# EAGLE design pi1541 (EAGLE 7.7.0)
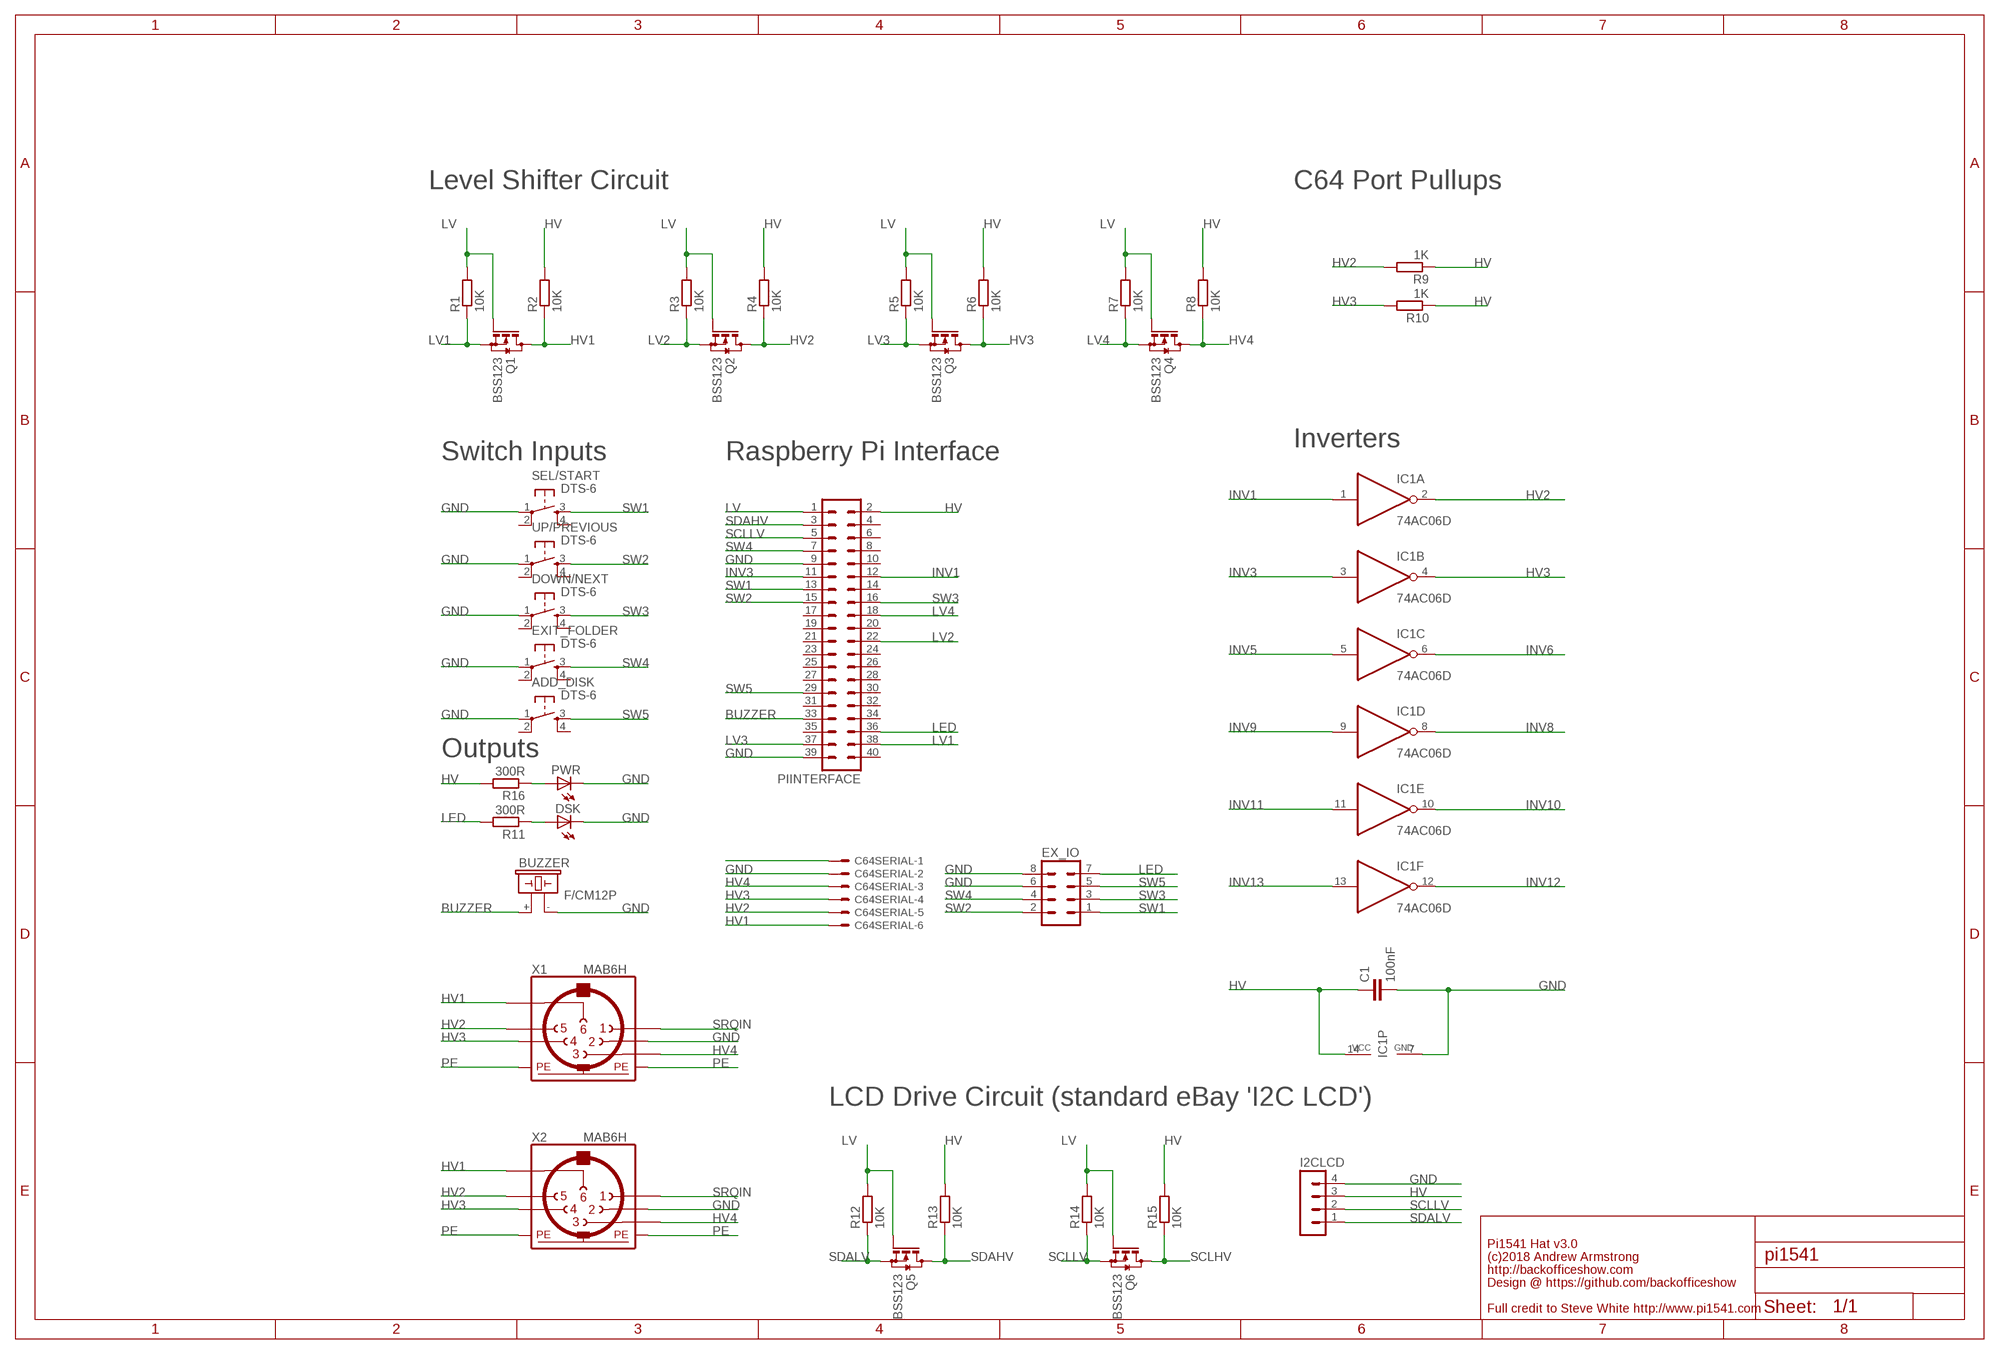
[diagram p0: schematic, sheet 1]

## Parts
ADD_DISK  DTS-6  [DTS-6]
BUZZER  F/CM12P  [F/CM12P]
C1  100nF  C-EUC0805  [C0805]
C64SERIAL  22-23-2061  [22-23-2061]
DOWN/NEXT  DTS-6  [DTS-6]
DSK  LEDCHIPLED_0805  [CHIPLED_0805]
EX_IO  MA04-2  [MA04-2]
EXIT_FOLDER  DTS-6  [DTS-6]
I2CLCD  MA04-1  [MA04-1]
IC1  74AC06D  [SO14]
PIINTERFACE  MA20-2  [MA20-2]
PWR  LEDCHIPLED_0805  [CHIPLED_0805]
Q1  BSS123  [SOT23]
Q2  BSS123  [SOT23]
Q3  BSS123  [SOT23]
Q4  BSS123  [SOT23]
Q5  BSS123  [SOT23]
Q6  BSS123  [SOT23]
R1  10K  R-EU_R0805  [R0805]
R2  10K  R-EU_R0805  [R0805]
R3  10K  R-EU_R0805  [R0805]
R4  10K  R-EU_R0805  [R0805]
R5  10K  R-EU_R0805  [R0805]
R6  10K  R-EU_R0805  [R0805]
R7  10K  R-EU_R0805  [R0805]
R8  10K  R-EU_R0805  [R0805]
R9  1K  R-EU_R0805  [R0805]
R10  1K  R-EU_R0805  [R0805]
R11  300R  R-EU_R0805  [R0805]
R12  10K  R-EU_R0805  [R0805]
R13  10K  R-EU_R0805  [R0805]
R14  10K  R-EU_R0805  [R0805]
R15  10K  R-EU_R0805  [R0805]
R16  300R  R-EU_R0805  [R0805]
SEL/START  DTS-6  [DTS-6]
UP/PREVIOUS  DTS-6  [DTS-6]
X1  MAB6H  [MAB6H]
X2  MAB6H  [MAB6H]

## Nets
BUZZER: BUZZER.+ PIINTERFACE.33
GND: ADD_DISK.1 BUZZER.- C1.2 C64SERIAL.2 DOWN/NEXT.1 DSK.C EX_IO.6 EX_IO.8 EXIT_FOLDER.1 I2CLCD.4 IC1.7(P:GND) PIINTERFACE.9 PIINTERFACE.39 PWR.C SEL/START.1 UP/PREVIOUS.1 X1.2 X2.2
HV: C1.1 I2CLCD.3 IC1.14(P:VCC) PIINTERFACE.2 R2.2 R4.2 R6.2 R8.2 R9.1 R10.1 R13.2 R15.2 R16.2
HV1: C64SERIAL.6 Q1.3(D) R2.1 X1.6 X2.6
HV2: C64SERIAL.5 IC1.2(A:O) Q2.3(D) R4.1 R9.2 X1.5 X2.5
HV3: C64SERIAL.4 IC1.4(B:O) Q3.3(D) R6.1 R10.2 X1.4 X2.4
HV4: C64SERIAL.3 Q4.3(D) R8.1 X1.3 X2.3
INV1: IC1.1(A:I) PIINTERFACE.12
INV3: IC1.3(B:I) PIINTERFACE.11
INV5: IC1.5(C:I)
INV6: IC1.6(C:O)
INV8: IC1.8(D:O)
INV9: IC1.9(D:I)
INV10: IC1.10(E:O)
INV11: IC1.11(E:I)
INV12: IC1.12(F:O)
INV13: IC1.13(F:I)
LED: EX_IO.7 PIINTERFACE.36 R11.2
LV: PIINTERFACE.1 Q1.1(G) Q2.1(G) Q3.1(G) Q4.1(G) Q5.1(G) Q6.1(G) R1.2 R3.2 R5.2 R7.2 R12.2 R14.2
LV1: PIINTERFACE.38 Q1.2(S) R1.1
LV2: PIINTERFACE.22 Q2.2(S) R3.1
LV3: PIINTERFACE.37 Q3.2(S) R5.1
LV4: PIINTERFACE.18 Q4.2(S) R7.1
N$1: DSK.A R11.1
N$2: C64SERIAL.1
N$4: PWR.A R16.1
PE: X1.PE X1.PE@(PE) X2.PE X2.PE@(PE)
SCLHV: Q6.3(D) R15.1
SCLLV: I2CLCD.2 PIINTERFACE.5 Q6.2(S) R14.1
SDAHV: PIINTERFACE.3 Q5.3(D) R13.1
SDALV: I2CLCD.1 Q5.2(S) R12.1
SRQIN: X1.1 X2.1
SW1: EX_IO.1 PIINTERFACE.13 SEL/START.3
SW2: EX_IO.2 PIINTERFACE.15 UP/PREVIOUS.3
SW3: DOWN/NEXT.3 EX_IO.3 PIINTERFACE.16
SW4: EX_IO.4 EXIT_FOLDER.3 PIINTERFACE.7
SW5: ADD_DISK.3 EX_IO.5 PIINTERFACE.29
Unconnected: ADD_DISK.2 ADD_DISK.4 DOWN/NEXT.2 DOWN/NEXT.4 EXIT_FOLDER.2 EXIT_FOLDER.4 PIINTERFACE.4 PIINTERFACE.6 PIINTERFACE.8 PIINTERFACE.10 PIINTERFACE.14 PIINTERFACE.17 PIINTERFACE.19 PIINTERFACE.20 PIINTERFACE.21 PIINTERFACE.23 PIINTERFACE.24 PIINTERFACE.25 PIINTERFACE.26 PIINTERFACE.27 PIINTERFACE.28 PIINTERFACE.30 PIINTERFACE.31 PIINTERFACE.32 PIINTERFACE.34 PIINTERFACE.35 PIINTERFACE.40 SEL/START.2 SEL/START.4 UP/PREVIOUS.2 UP/PREVIOUS.4

## Notes on the sheet
- Level Shifter Circuit | C64 Port Pullups
- Inverters
- Switch Inputs | Raspberry Pi Interface
- Outputs
- LCD Drive Circuit (standard eBay 'I2C LCD')
- Pi1541 Hat v3.0
- (c)2018 Andrew Armstrong
- http://backofficeshow.com
- Design @ https://github.com/backofficeshow
- Full credit to Steve White http://www.pi1541.com

## Library data of the parts
ADD_DISK DOWN/NEXT EXIT_FOLDER SEL/START UP/PREVIOUS = switch-tact:DTS-6
BUZZER = buzzer:F/CM12P: BUZZER Source: Buerklin
C1 = rcl:C-EU: CAPACITOR, European symbol
C64SERIAL = con-molex:22-23-2061: .100" (2.54mm) Center Header - 6 Pin
DSK PWR = led:LED: LED OSRAM: - CHIPLED LG R971, LG N971, LY N971, LG Q971, LY Q971, LO R971, LY R971 LH N974, LH R974 LS Q976, LO Q976, LY Q976 LO Q996 - Hyper CHIPLED LW Q18S LB Q993, LB Q99A, LB R99A - SideLED LS A670, LO A670, LY A670, LG A670, LP A670 LB A673, LV A673, LT A673, LW A673 LH A674 LY A675 LS A676, LA A676, LO A676, LY A676, LW A676 LS A679, LY A679, LG A679 - Hyper Micro SIDELED® LS Y876, LA Y876, LO Y876, LY Y876 LT Y87S - SmartLED LW L88C, LW L88S LB L89C, LB L89S, LG L890 LS L89K, LO L89K, LY L89K LS L896, LA L896, LO L896, LY L896 - TOPLED LS T670, LO T670, LY T670, LG T670, LP T670 LSG T670, LSP T670, LSY T670, LOP T670, LYG T670 LG T671, LOG T671, LSG T671 LB T673, LV T673, LT T673, LW T673 LH T674 LS T676, LA T676, LO T676, LY T676, LB T676, LH T676, LSB T676, LW T676 LB T67C, LV T67C, LT T67C, LS T67K, LO T67K, LY T67K, LW E67C LS E67B, LA E67B, LO E67B, LY E67B, LB E67C, LV E67C, LT E67C LW T67C LS T679, LY T679, LG T679 LS T770, LO T770, LY T770, LG T770, LP T770 LB T773, LV T773, LT T773, LW T773 LH T774 LS E675, LA E675, LY E675, LS T675 LS T776, LA T776, LO T776, LY T776, LB T776 LHGB T686 LT T68C, LB T68C - Hyper Mini TOPLED® LB M676 - Mini TOPLED Santana® LG M470 LS M47K, LO M47K, LY M47K Source: http://www.osram.convergy.de LUXEON: - LUMILED® LXK2-PW12-R00, LXK2-PW12-S00, LXK2-PW14-U00, LXK2-PW14-V00 LXK2-PM12-R00, LXK2-PM12-S00, LXK2-PM14-U00 LXK2-PE12-Q00, LXK2-PE12-R00, LXK2-PE12-S00, LXK2-PE14-T00, LXK2-PE14-U00 LXK2-PB12-K00, LXK2-PB12-L00, LXK2-PB12-M00, LXK2-PB14-N00, LXK2-PB14-P00, LXK2-PB14-Q00 LXK2-PR12-L00, LXK2-PR12-M00, LXK2-PR14-Q00, LXK2-PR14-R00 LXK2-PD12-Q00, LXK2-PD12-R00, LXK2-PD12-S00 LXK2-PH12-R00, LXK2-PH12-S00 LXK2-PL12-P00, LXK2-PL12-Q00, LXK2-PL12-R00 Source: www.luxeon.com KINGBRIGHT: KA-3528ASYC Source: www.kingbright.com
EX_IO = con-lstb:MA04-2: PIN HEADER
I2CLCD = con-lstb:MA04-1: PIN HEADER
IC1 = 74xx-eu:74*06: Hex INVERTER, open collector high-voltage output
PIINTERFACE = con-lstb:MA20-2: PIN HEADER
Q1-Q6 = transistor-small-signal:BSS123: N-CHANNEL MOS FET
R1-R16 = resistor:R-EU_: RESISTOR, European symbol
X1 X2 = con-hirschmann:MAB6H: Female CONNECTOR 6 pins with shield, horizontal (DIN 45322)

## Net classes
0 default: width 0.3 mm

## Board
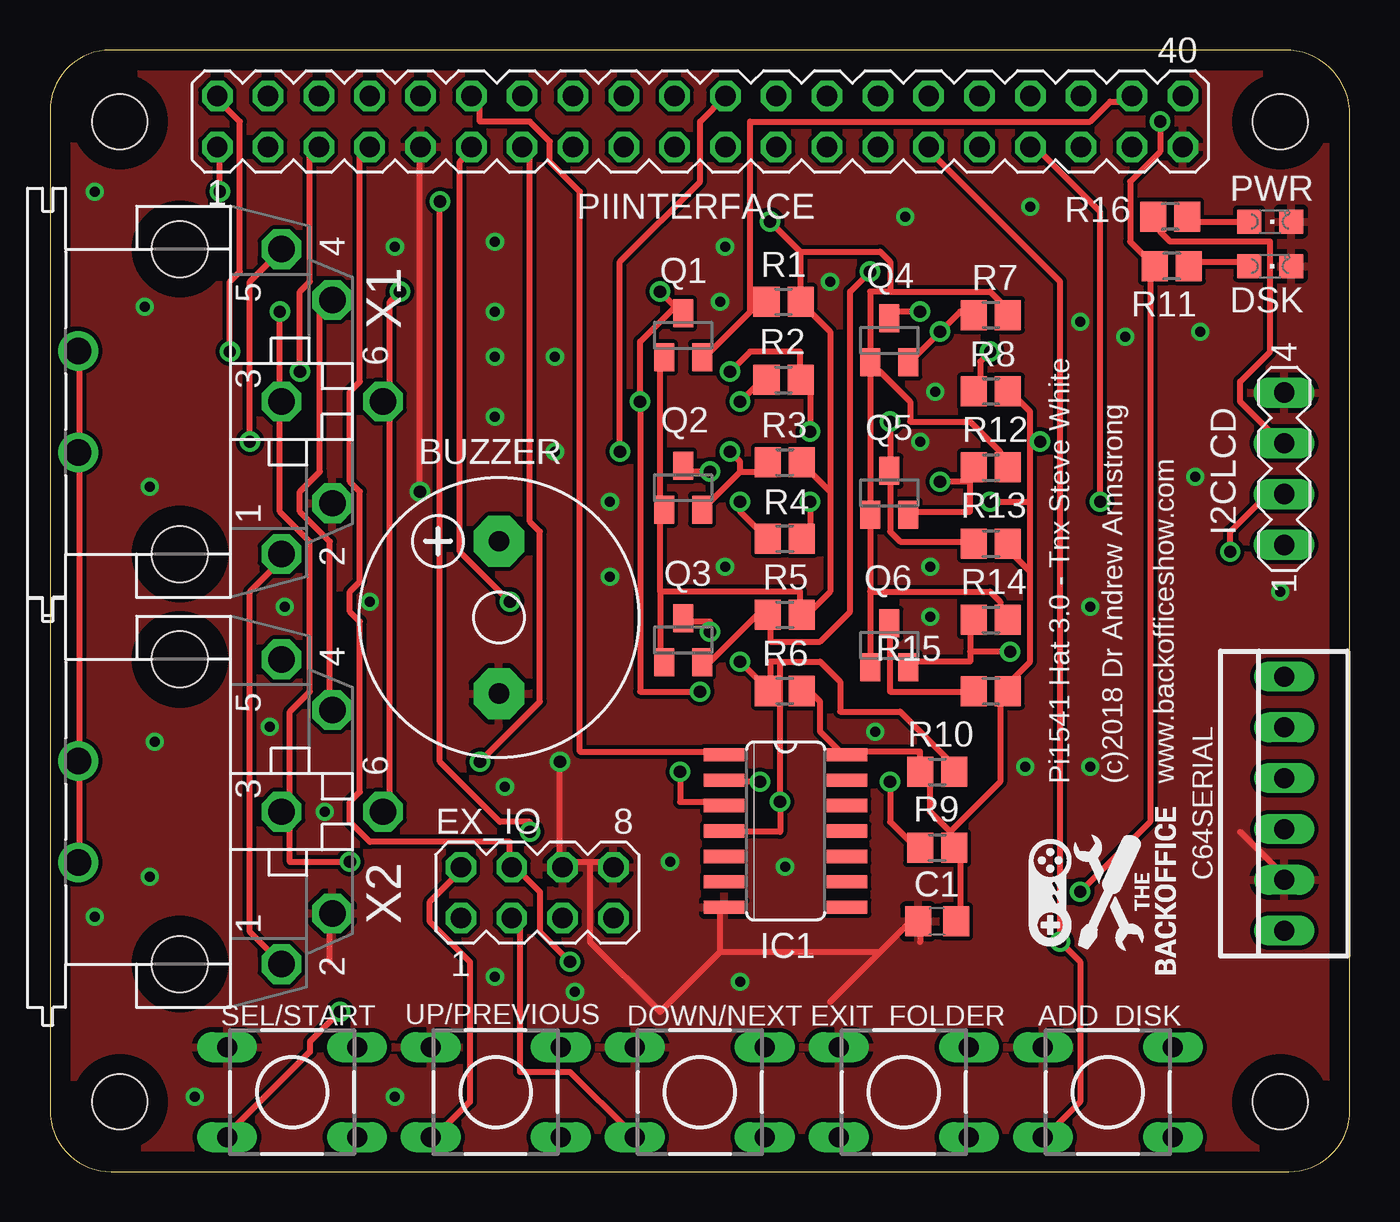
[diagram p1: board, top side]
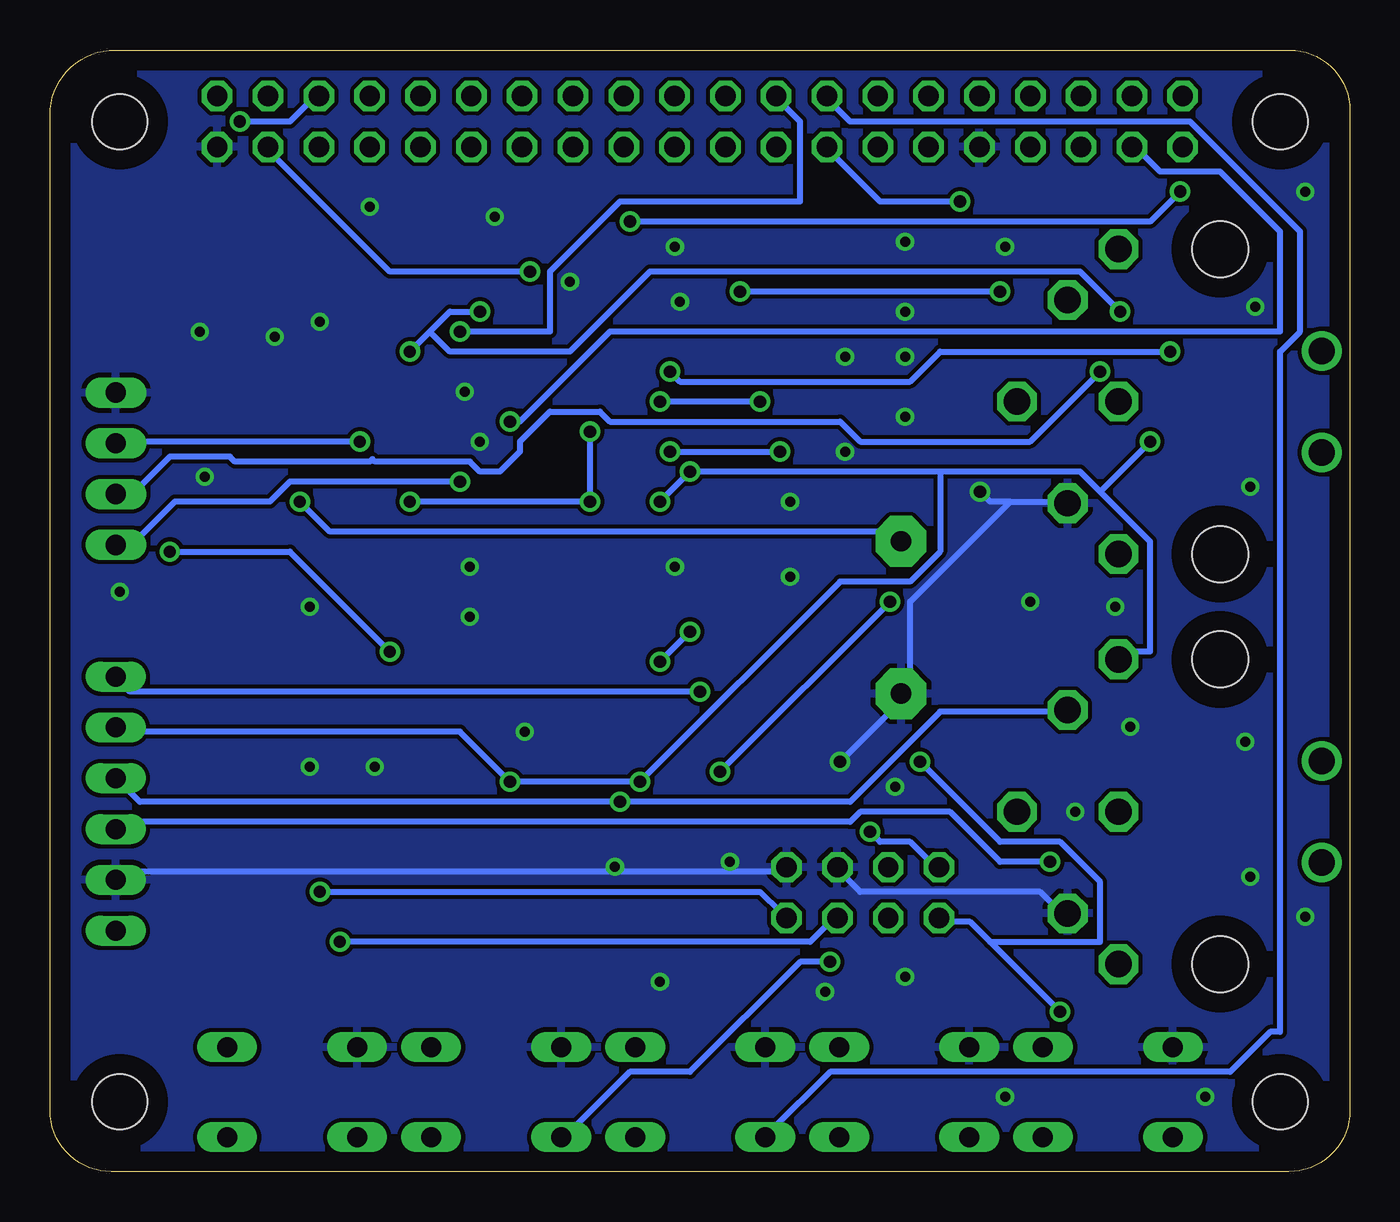
[diagram p2: board, bottom side, seen from below]

Size 64.98 x 56.07 mm. Coordinates in mm from the lower left corner, seen from the top.
Outline: 61.91,0 arc90 64.98,3.07 64.98,52.82 arc90 61.73,56.07 3.02,56.07 arc90 0,53.05 0,3.07 arc90 3.07,0 61.91,0
Copper layers (1*16): Top 0.035mm / dielectric 1.5mm / Bottom 0.035mm
Design rules "default *": minimum track width 10mil, minimum drill 24mil, track to track 8mil, track to pad 8mil, pad to pad 8mil, via to via 8mil, smd to smd 8mil, copper to edge 40mil, drill to drill 8mil, minimum pad ring 10mil, minimum via ring 8mil, stop-mask expansion 4mil, vias tented up to drill 0.7mm, thermal gap 10mil
Holes 2.75 mm at 3.49,3.49 61.49,3.49 3.49,52.49 61.49,52.49

### Footprints (pad centres in the part's own frame; a part is rotated, then mirrored left to right if it is on the bottom)
DTS-6 = drill 1 long: 1 -3.25,2.25; 2 3.25,2.25; 3 -3.25,-2.25; 4 3.25,-2.25
F/CM12P = drill 1.016 pad 2.54 octagon: + 3.81,0; - -3.81,0
C0805 = smd 1.3 x 1.5: 1 -0.95,0; 2 0.95,0
22-23-2061 = drill 1 long: 1 -6.35,0; 2 -3.81,0; 3 -1.27,0; 4 1.27,0; 5 3.81,0; 6 6.35,0
CHIPLED_0805 = smd 1.2 x 1.2: A 0,-1.05; C 0,1.05
MA04-2 = drill 1.016 octagon: 1 -3.81,-1.27; 2 -3.81,1.27; 3 -1.27,-1.27; 4 -1.27,1.27; 5 1.27,-1.27; 6 1.27,1.27; 7 3.81,-1.27; 8 3.81,1.27
MA04-1 = drill 1.016 long: 1 -3.81,0; 2 -1.27,0; 3 1.27,0; 4 3.81,0
SO14 = smd 0.66 x 2.032: 1 -3.81,-3.073; 2 -2.54,-3.073; 3 -1.27,-3.073; 4 0,-3.073; 5 1.27,-3.073; 6 2.54,-3.073; 7 3.81,-3.073; 8 3.81,3.073; 9 2.54,3.073; 10 1.27,3.073; 11 0,3.073; 12 -1.27,3.073; 13 -2.54,3.073; 14 -3.81,3.073
MA20-2 = drill 1.016 octagon: 1 -24.13,-1.27; 2 -24.13,1.27; 3 -21.59,-1.27; 4 -21.59,1.27; 5 -19.05,-1.27; 6 -19.05,1.27; 7 -16.51,-1.27; 8 -16.51,1.27; 9 -13.97,-1.27; 10 -13.97,1.27; 11 -11.43,-1.27; 12 -11.43,1.27; 13 -8.89,-1.27; 14 -8.89,1.27; 15 -6.35,-1.27; 16 -6.35,1.27; 17 -3.81,-1.27; 18 -3.81,1.27; 19 -1.27,-1.27; 20 -1.27,1.27; 21 1.27,-1.27; 22 1.27,1.27; 23 3.81,-1.27; 24 3.81,1.27; 25 6.35,-1.27; 26 6.35,1.27; 27 8.89,-1.27; 28 8.89,1.27; 29 11.43,-1.27; 30 11.43,1.27; 31 13.97,-1.27; 32 13.97,1.27; 33 16.51,-1.27; 34 16.51,1.27; 35 19.05,-1.27; 36 19.05,1.27; 37 21.59,-1.27; 38 21.59,1.27; 39 24.13,-1.27; 40 24.13,1.27
SOT23 = smd 1 x 1.4: 1 -0.95,-1.1; 2 0.95,-1.1; 3 0,1.1
R0805 = smd 1.3 x 1.5: 1 -0.85,0; 2 0.85,0
MAB6H = drill 1.321 octagon: 1 7.62,5.08; 2 5.08,7.62; 3 0,5.08; 4 -5.08,7.62; 5 -7.62,5.08; 6 0,10.16 | drill 1.321: PE -2.54,-5.08; PE@ 2.54,-5.08 | hole 2.794: 7.62,0; -7.62,0

### Placement (x,y rotation side)
ADD_DISK  52.88,3.98 0 top
BUZZER  22.44,27.71 90 top
C1  44.34,12.51 180 top
C64SERIAL  61.69,18.4 90 top
DOWN/NEXT  32.48,3.98 0 top
DSK  60.99,45.27 270 top
EX_IO  24.35,13.95 0 top
EXIT_FOLDER  42.68,3.98 0 top
I2CLCD  61.69,35.14 90 top
IC1  36.77,17.03 270 top
PIINTERFACE  32.49,52.49 0 top
PWR  60.99,47.49 270 top
Q1  31.65,41.81 0 top
Q2  31.65,34.19 0 top
Q3  31.65,26.57 0 top
Q4  41.95,41.55 0 top
Q5  41.95,33.93 0 top
Q6  41.95,26.31 0 top
R1  36.66,43.49 0 top
R2  36.66,39.59 0 top
R3  36.73,35.46 0 top
R4  36.73,31.65 0 top
R5  36.73,27.84 0 top
R6  36.73,24.03 0 top
R7  47.03,42.82 0 top
R8  47.03,39.01 0 top
R9  44.34,16.19 180 top
R10  44.35,19.99 0 top
R11  56.07,45.27 180 top
R12  47.03,35.2 0 top
R13  47.03,31.39 0 top
R14  47.03,27.58 0 top
R15  47.03,24.02 0 top
R16  55.99,47.74 180 top
SEL/START  12.1,3.98 0 top
UP/PREVIOUS  22.28,3.98 0 top
X1  6.49,38.49 270 top
X2  6.49,17.99 270 top

### Tracks (layer width: path | path; a pad name or v marks a point on that pad's centre or on a via)
BUZZER  (via drill 0.61)
  Top 0.3: v52.49,33.49 52.49,47.99 49.49,50.99 PIINTERFACE.33
  Bottom 0.3: v52.49,33.49 50.99,31.99 22.49,31.99 BUZZER.+
GND  (via drill 0.5, 0.61)
  Top 0.3: v18.49,33.99 18.49,50.99 PIINTERFACE.9 | 33.49,10.99 30.49,7.99 26.99,11.49 26.99,15.49 | 33.49,10.99 33.49,12.99 IC1.7 | 41.49,10.99 38.99,8.49 | 41.49,10.99 42.99,12.49 C1.2 43.49,12.49 43.49,11.49 | 33.49,10.99 41.49,10.99 | 13.99,10.49 13.99,12.49 X2.2 | 26.99,15.49 27.99,15.49 EX_IO.8 | 26.99,15.49 25.99,15.49 EX_IO.6 25.49,15.49 v25.49,20.49 | 59.49,16.99 61.49,14.99 C64SERIAL.2
  Bottom 0.3: v18.49,33.99 17.99,33.49 16.99,33.49 | 16.99,33.49 14.49,33.49 X1.2 | 16.99,33.49 21.99,28.49 21.99,23.99 BUZZER.- 22.49,23.49 v25.49,20.49 | C64SERIAL.2 61.49,14.99 28.49,14.99 EX_IO.8 | X2.2 14.49,12.99 15.49,13.99 24.49,13.99 25.49,14.99 EX_IO.6
  other vias: 27.99,29.74 27.99,33.49 25.24,35.99 25.24,40.74 42.74,47.74 53.74,41.74 22.24,46.49 17.24,46.24 4.74,43.24 2.24,48.99 4.99,14.74 22.24,9.74 26.24,8.99 36.74,15.24 51.99,28.24 61.49,28.99 43.99,30.24 57.49,41.99 48.99,48.24 51.49,42.49 22.24,42.99 22.24,40.74 33.74,46.24 33.49,43.49 51.99,20.24 41.24,21.99 33.74,30.24 22.74,19.24 30.99,15.49 11.74,28.24 10.99,22.24 13.74,17.99 15.99,28.49 22.24,37.74 38.99,44.49 48.74,20.24 43.99,27.74 4.99,34.24 5.24,21.49 17.24,3.74 7.24,3.74 34.49,9.49 2.24,12.74 44.24,38.99 43.49,36.49 57.24,34.74
  pour Top: -8.51,57.49 67.99,57.49 67.99,-8.01 -9.51,-8.01 -9.51,56.49
  pour Bottom: -2.01,58.74 74.49,58.74 74.49,-4.76 -6.01,-4.76 -6.01,58.49
HV  (via drill 0.61)
  Top 0.3: R6.2 37.99,23.99 38.49,23.49 38.49,21.99 39.49,20.99 IC1.14 39.99,20.99 43.49,20.99 R10.1 43.99,19.49 43.99,17.99 44.99,16.99 | C1.1 45.49,12.99 45.49,15.99 R9.1 44.99,16.49 44.99,16.99 | 44.99,16.99 47.49,19.49 47.49,23.99 R15.2 47.99,24.49 48.99,25.49 48.99,29.99 | R16.2 55.49,47.49 55.49,46.99 55.99,46.49 60.99,46.49 60.99,40.99 59.49,39.49 59.49,38.49 61.49,36.49 I2CLCD.3 | 48.99,29.99 47.99,30.99 R13.2 | 48.99,29.99 48.99,33.49 | 48.99,33.49 48.99,36.49 | 48.99,36.49 48.99,37.99 47.99,38.99 R8.2 | v37.99,33.49 37.99,31.99 R4.2 | v37.99,36.99 37.99,39.49 R2.2 37.49,39.99 37.49,40.99 34.99,40.99 v33.99,39.99 | v8.99,40.99 8.99,44.49 9.49,44.99 9.49,52.49 8.49,53.49 PIINTERFACE.2 | v46.99,33.49 48.99,33.49 | 48.99,36.49 v49.49,36.49
  Bottom 0.3: v37.99,36.99 v37.99,33.49 v46.99,33.49 | v8.99,40.99 20.49,40.99 21.99,39.49 33.49,39.49 v33.99,39.99 | v49.49,36.49 61.49,36.49 I2CLCD.3
HV1  (via drill 0.61)
  Top 0.3: v30.49,43.99 31.24,43.24 | 31.24,43.24 31.49,42.99 Q1.3 31.24,43.24 | v17.49,43.99 16.99,43.49 16.99,38.49 | v34.49,38.49 35.49,39.49 R2.1 | v32.49,23.99 29.49,23.99 v29.49,38.49 29.49,41.49 31.24,43.24 | 16.99,38.49 16.99,17.99 X2.6 | 16.99,38.49 X1.6
  Bottom 0.3: v17.49,43.99 v30.49,43.99 | v29.49,38.49 v34.49,38.49 | v32.49,23.99 60.99,23.99 61.49,24.49 C64SERIAL.6
HV2  (via drill 0.61)
  Top 0.3: v41.99,19.49 41.99,17.49 42.99,16.49 R9.2 | v35.49,19.49 33.99,19.49 IC1.2 | v32.99,34.99 31.99,34.99 Q2.3 | v34.49,33.49 34.49,32.99 35.49,31.99 R4.1 | v9.99,36.49 9.99,44.49 11.49,45.99 X1.5
  Bottom 0.3: C64SERIAL.5 61.49,21.99 44.49,21.99 v41.99,19.49 v35.49,19.49 25.49,29.49 21.99,29.49 20.49,30.99 20.49,34.99 | 20.49,34.99 13.49,34.99 12.49,33.99 | 20.49,34.99 v32.99,34.99 v34.49,33.49 | 12.49,33.99 9.99,31.49 9.99,25.99 11.49,25.99 X2.5 | 12.49,33.99 v9.99,36.49
HV3  (via drill 0.61)
  Top 0.3: v32.99,26.99 32.99,27.49 31.99,27.49 Q3.3 | v34.49,25.49 35.49,24.49 R6.1 35.99,24.49 35.99,25.49 36.49,25.49 | 36.49,25.49 38.49,25.49 39.49,24.49 39.49,22.99 42.49,22.99 44.99,20.49 44.99,19.99 R10.2 | 36.49,25.49 v36.49,18.49 36.49,16.99 33.99,16.99 IC1.4 | X1.4 13.99,43.49 13.49,42.99 13.49,34.99 12.49,33.99 12.49,32.99 13.99,31.49 13.99,23.49 X2.4
  Bottom 0.3: v34.49,25.49 v32.99,26.99 | C64SERIAL.4 61.49,19.49 60.49,18.49 v36.49,18.49 24.99,18.49 20.49,22.99 14.49,22.99 X2.4
HV4  (via drill 0.61)
  Top 0.3: v43.49,42.99 41.99,42.99 Q4.3 | v46.99,40.99 46.49,40.49 46.49,39.49 R8.1 | v14.99,15.49 11.99,15.49 11.99,17.99 | 11.49,38.49 11.49,32.99 12.99,31.49 12.99,23.99 11.99,22.99 11.99,17.99 | 11.99,17.99 X2.3 | 11.49,38.49 v11.49,42.99 | 11.49,38.49 X1.3
  Bottom 0.3: v43.49,42.99 44.99,42.99 45.99,41.99 | 45.99,41.99 v46.99,40.99 | v14.99,15.49 17.49,15.49 19.99,17.99 24.49,17.99 24.99,17.49 61.49,17.49 C64SERIAL.3 | 45.99,41.99 44.99,40.99 38.99,40.99 34.99,44.99 13.49,44.99 v11.49,42.99
INV1
  Top 0.3: IC1.1 33.49,20.99 26.49,20.99 26.49,48.99 24.99,50.49 24.99,51.49 23.99,52.49 21.49,52.49 21.49,53.49 PIINTERFACE.12
INV3  (via drill 0.61)
  Top 0.3: v31.49,19.99 31.49,18.49 33.49,18.49 IC1.3 | v22.99,28.49 20.49,30.99 20.49,50.49 20.99,50.99 PIINTERFACE.11
  Bottom 0.3: v31.49,19.99 v22.99,28.49
LED  (via drill 0.61)
  Top 0.3: v55.49,52.49 55.49,50.99 53.99,49.49 53.99,46.49 54.99,45.49 R11.2 54.99,44.99 54.99,17.49 v51.49,13.99
  Bottom 0.3: v55.49,52.49 52.99,52.49 51.99,53.49 PIINTERFACE.36 | v51.49,13.99 29.49,13.99 28.49,12.99 EX_IO.7
LV  (via drill 0.61)
  Top 0.3: 40.99,28.99 40.99,32.49 Q5.1 40.99,32.99 40.99,39.99 Q4.1 | 40.99,28.99 40.99,25.49 Q6.1 | 40.99,28.99 46.99,28.99 47.49,28.49 47.49,27.99 R14.2 | 41.99,43.99 40.99,43.99 40.99,40.49 Q4.1 | 41.99,43.99 46.99,43.99 47.49,43.49 47.49,42.99 R7.2 | 30.49,28.99 30.49,32.99 Q2.1 30.49,33.49 30.49,40.49 Q1.1 | 30.49,28.99 30.49,25.49 Q3.1 | 38.99,33.99 38.99,28.99 37.99,27.99 R5.2 37.49,27.99 37.49,28.99 30.49,28.99 | 38.99,33.99 37.99,34.99 R3.2 | 38.99,33.99 38.99,41.99 37.99,42.99 R1.2 37.49,43.49 37.49,45.99 | v8.49,48.99 8.49,50.99 PIINTERFACE.1 | v35.99,47.49 37.49,45.99 | 41.99,43.99 41.99,45.49 41.49,45.99 37.49,45.99 | R12.2 47.49,35.49 47.49,35.99 45.99,37.49 42.99,37.49 42.99,38.49 41.49,39.99 Q4.1
  Bottom 0.3: v8.49,48.99 9.99,47.49 v35.99,47.49
LV1
  Top 0.3: 34.99,42.99 35.49,43.49 R1.1 | 34.99,42.99 32.99,40.99 Q1.2 | 34.99,42.99 34.99,52.49 51.99,52.49 52.99,53.49 53.99,53.49 PIINTERFACE.38
LV2  (via drill 0.61)
  Top 0.3: 34.49,34.99 32.99,33.49 Q2.2 | 34.49,34.99 35.49,34.99 R3.1 | v28.49,35.99 28.49,45.49 32.49,49.49 32.49,52.49 PIINTERFACE.22 | v33.99,35.99 34.49,35.49 34.49,34.99
  Bottom 0.3: v33.99,35.99 v28.49,35.99
LV3  (via drill 0.61)
  Top 0.3: Q3.2 32.99,25.49 35.49,27.99 R5.1 35.99,27.49 35.99,26.49 38.49,26.49 39.99,27.99 39.99,43.99 v40.99,44.99
  Bottom 0.3: v40.99,44.99 47.99,44.99 53.99,50.99 PIINTERFACE.37
LV4  (via drill 0.61)
  Top 0.3: Q4.2 42.99,40.49 v44.49,41.99 45.49,42.99 45.99,42.99 R7.1
  Bottom 0.3: v44.49,41.99 39.99,41.99 39.99,44.99 36.49,48.49 27.49,48.49 27.49,52.49 28.49,53.49 PIINTERFACE.18
N$1
  Top 0.3: DSK.A 59.49,45.49 56.99,45.49 R11.1
N$4
  Top 0.3: PWR.A 56.99,47.49 R16.1
PE
  Top 0.3: X2.PE@ 1.49,15.49 1.49,20.49 X2.PE 1.49,20.99 1.49,35.49 X1.PE@ 1.49,35.99 1.49,40.99 X1.PE
SCLHV
  Top 0.3: Q6.3 41.99,26.99 41.99,23.99 45.99,23.99 R15.1
SCLLV  (via drill 0.61)
  Top 0.3: 45.99,25.99 45.99,27.49 R14.1 | 45.99,25.99 45.99,25.49 42.99,25.49 Q6.2 | v12.49,39.99 12.49,43.99 12.99,44.49 12.99,50.99 PIINTERFACE.5 | v47.99,25.99 45.99,25.99
  Top 0.305: v58.99,30.99 58.99,31.99 60.74,33.74 61.56,33.74 I2CLCD.2
  Bottom 0.3: v12.49,39.99 15.99,36.49 24.49,36.49 25.49,37.49 36.99,37.49 37.49,37.99 39.99,37.99 41.49,36.49 | 48.99,35.49 48.87,35.62 | 61.49,33.99 I2CLCD.2 | v47.99,25.99 52.99,30.99 v58.99,30.99
  Bottom 0.305: 41.49,36.49 41.49,35.99 42.49,34.99 43.49,34.99 43.99,35.49 48.74,35.49 48.87,35.62 | I2CLCD.2 61.56,33.74 60.99,33.74 58.99,35.74 55.99,35.74 55.74,35.49 48.99,35.49
SDAHV  (via drill 0.61)
  Top 0.3: R13.1 45.99,31.49 42.49,31.49 41.99,31.99 41.99,34.99 Q5.3 41.99,35.49 v41.99,37.49
  Bottom 0.3: v41.99,37.49 41.49,37.49 36.99,41.99 3.49,41.99 3.49,46.99 6.49,49.99 9.49,49.99 10.49,50.99 PIINTERFACE.3
SDALV  (via drill 0.61)
  Top 0.3: 45.99,34.49 45.99,32.99 42.99,32.99 Q5.2 | 45.99,34.49 45.99,34.99 R12.1 45.99,34.49 | 45.99,34.49 v44.49,34.49
  Bottom 0.3: 53.49,33.99 52.99,34.49 v44.49,34.49 | 61.49,31.49 I2CLCD.1
  Bottom 0.305: 53.49,33.99 53.99,33.49 58.74,33.49 60.99,31.24 61.6,31.24 I2CLCD.1
SRQIN
  Top 0.3: X2.1 11.49,10.49 9.99,11.99 9.99,28.99 11.49,30.49 X1.1
SW1  (via drill 0.61)
  Top 0.3: v21.49,20.49 24.49,23.49 24.49,31.99 23.99,32.49 23.99,50.99 PIINTERFACE.13 | v14.49,7.99 12.99,6.49 12.99,5.99 8.99,1.99 SEL/START.3
  Bottom 0.3: 17.99,11.49 18.99,12.49 20.49,12.49 EX_IO.1 | v14.49,7.99 17.99,11.49 | v21.49,20.49 17.49,16.49 14.49,16.49 12.49,14.49 12.49,11.49 17.99,11.49
SW2  (via drill 0.61)
  Top 0.3: EX_IO.2 20.49,14.99 18.99,13.49 18.99,12.49 20.99,10.49 20.99,3.49 19.49,1.99 UP/PREVIOUS.3 | v19.49,48.49 19.49,20.49 22.49,17.49 23.99,17.49 v23.99,16.99
  Bottom 0.3: v19.49,48.49 23.49,48.49 25.99,50.99 PIINTERFACE.15 | v23.99,16.99 23.49,16.49 21.99,16.49 20.99,15.49 EX_IO.2
SW3
  Top 0.3: DOWN/NEXT.3 28.99,1.99 25.99,4.99 23.49,4.99 23.49,12.49 EX_IO.3
  Bottom 0.3: PIINTERFACE.16 25.99,53.49 24.99,52.49 7.99,52.49 2.49,46.99 2.49,41.99 3.49,40.99 3.49,6.99 3.99,6.99 5.99,4.99 25.99,4.99 28.99,1.99 DOWN/NEXT.3 | 22.99,12.49 EX_IO.3
SW4  (via drill 0.61)
  Top 0.3: PIINTERFACE.7 15.49,50.99 15.49,39.49 14.99,38.99 14.99,34.49 15.49,33.99 15.49,29.49 14.99,28.99 14.99,27.99 15.49,27.49 15.49,18.99 14.99,18.49 14.99,17.49 15.99,16.49 22.99,16.49 22.99,15.49 EX_IO.4 23.49,14.99 24.49,13.99 24.49,11.99 v25.99,10.49
  Bottom 0.3: v25.99,10.49 27.49,10.49 32.99,4.99 35.99,4.99 38.99,1.99 EXIT_FOLDER.3
SW5  (via drill 0.61)
  Top 0.3: PIINTERFACE.29 43.99,50.99 50.49,44.49 v50.49,11.49 51.49,10.49 51.49,3.49 49.99,1.99 ADD_DISK.3
  Bottom 0.3: v50.49,11.49 26.99,11.49 25.99,12.49 EX_IO.5

### Text on the board
tPlace: Pi1541 Hat 3.0 - Tnx Steve White | (c)2018 Dr Andrew Armstrong | www.backofficeshow.com